# EAGLE schematic OBI_SlaveBoard_final (EAGLE 7.1.0)
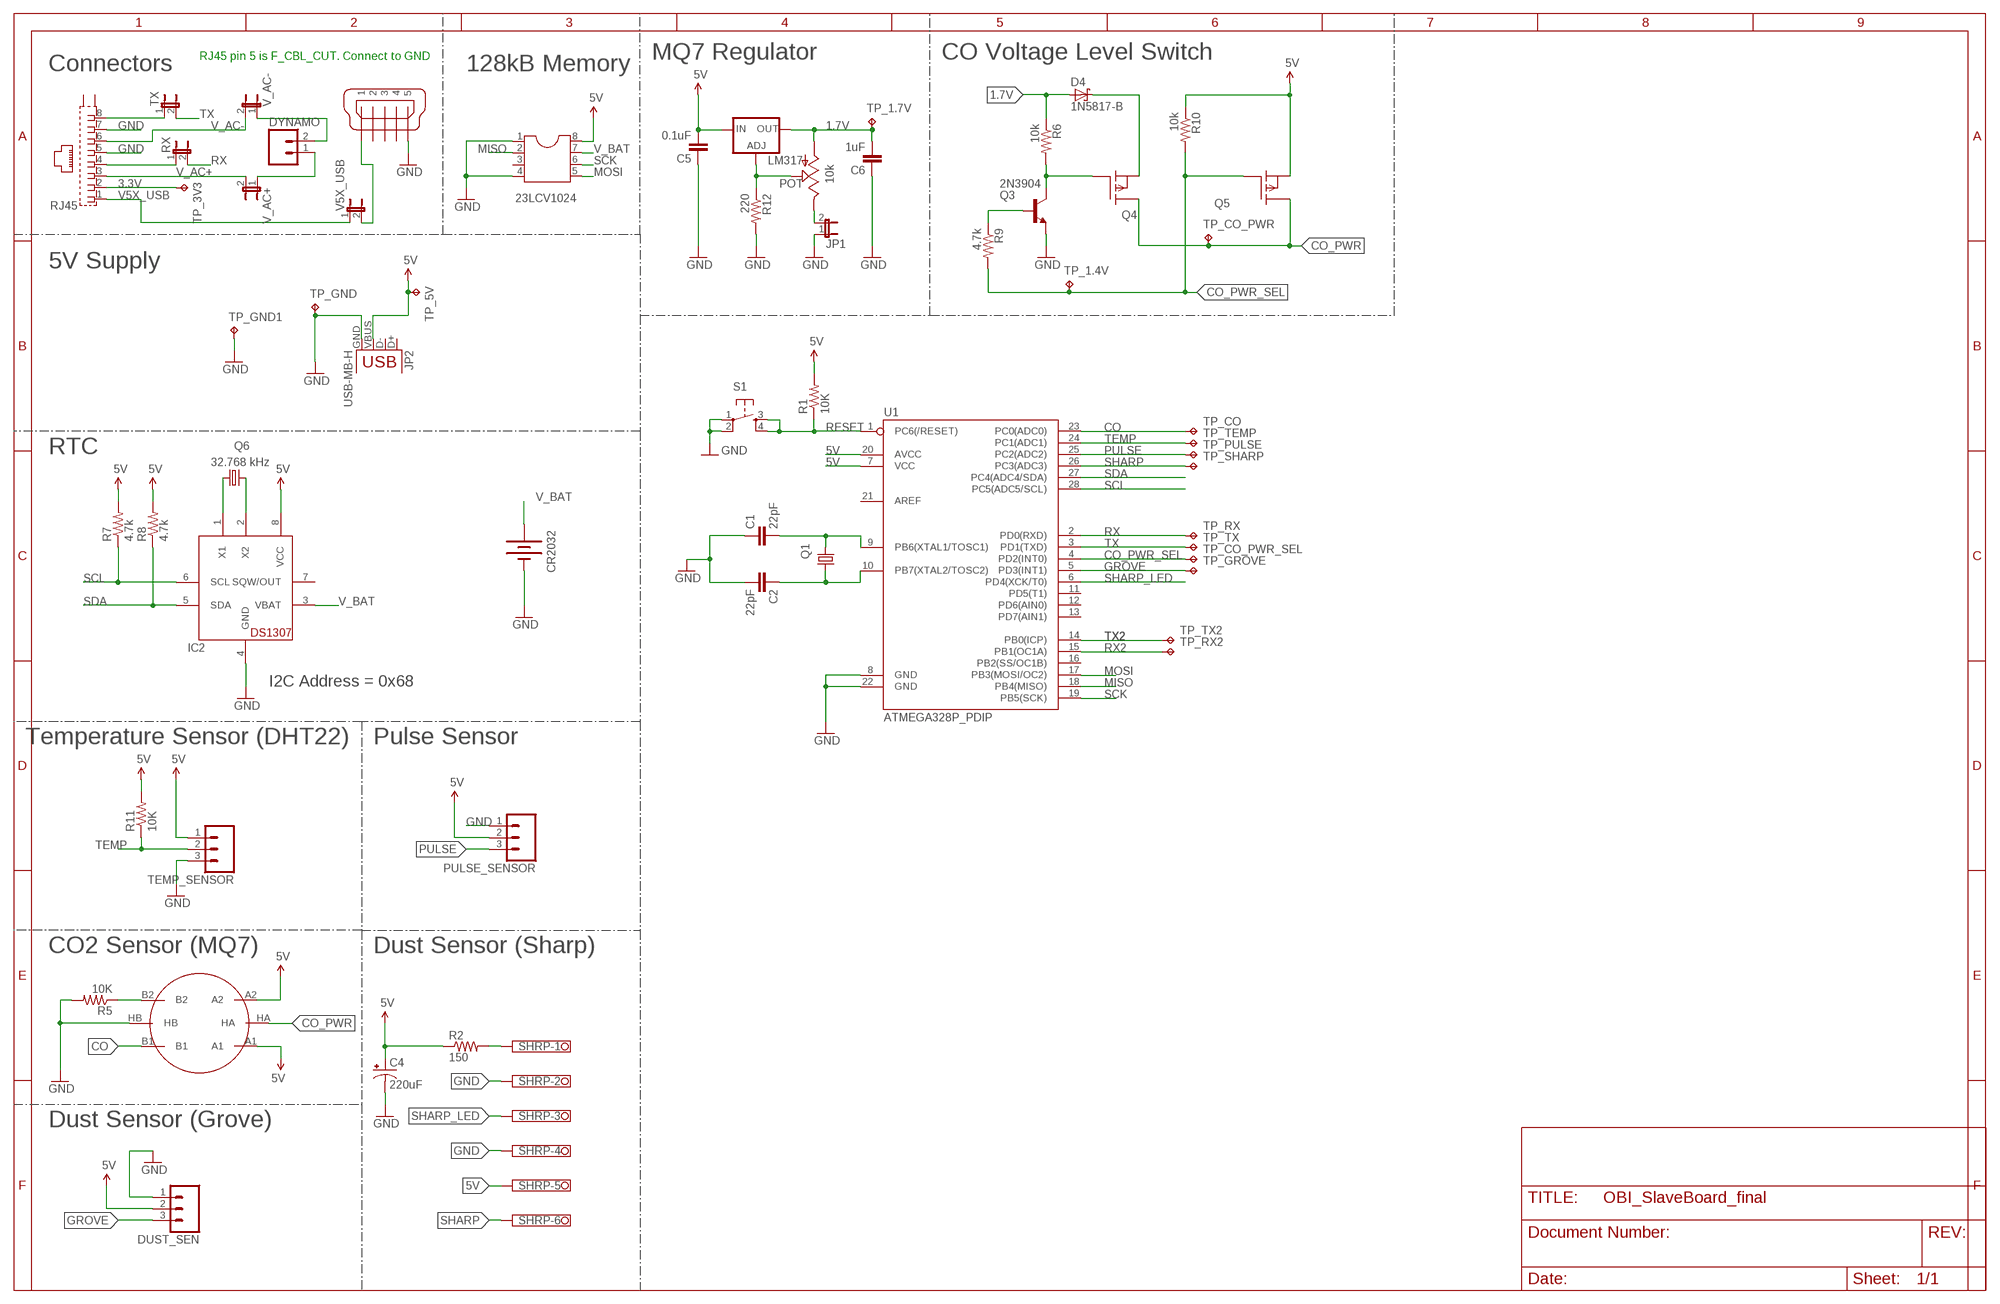
[diagram p0: schematic, sheet 1]

## Parts
23LCV1024  DIL8S  [SOCKET-08]
C1  22pF  C-EU025-024X044  [C025-024X044]
C2  22pF  C-EU025-024X044  [C025-024X044]
C4  220uF  CAP_POLPTH2  [CPOL-RADIAL-10UF-25V]
C5  0.1uF  C-EU025-024X044  [C025-024X044]
C6  1uF  C-EU025-024X044  [C025-024X044]
CO2_SENSOR  METHANE_SENSOR  [MQ-3]
CR2032  BATTERY20PTH  [BATTCOM_20MM_PTH]
D4  1N5817-B  SCHOTTKY-DIODEDO41  [DO41-10]
DUST_SEN  M03SCREW  [SCREWTERMINAL-3.5MM-3]
DYNAMO  M023.5MM  [SCREWTERMINAL-3.5MM-2]
IC2  DS1307  [DIL08]
JP1  JP1E  [JP1]
JP2  USB-MB-H  [USB-MB-H]
LM317  LM317TS  [317TS]
MICROB  MICRO-USB-ZX62R-B-5P  [ZX62R-B-5P]
POT  10k  TRIM_US-CT6  [CT6]
PULSE_SENSOR  M03SCREW  [SCREWTERMINAL-3.5MM-3]
Q1  CRYSTALHC49S  [HC49/S]
Q3  2N3904  TRANSISTOR_NPN2N3904  [TO-92]
Q4  BSS110  [TO92]
Q5  BSS110  [TO92]
Q6  32.768 kHz  CRYSTALTC26V  [TC26V]
R1  10K  R-US_0207/2V  [0207/2V]
R2  150  R-US_0207/2V  [0207/2V]
R5  10K  R-US_0207/2V  [0207/2V]
R6  10k  R-US_0207/2V  [0207/2V]
R7  4.7k  R-US_0207/2V  [0207/2V]
R8  4.7k  R-US_0207/2V  [0207/2V]
R9  4.7k  R-US_0207/2V  [0207/2V]
R10  10k  R-US_0207/2V  [0207/2V]
R11  10K  R-US_0207/2V  [0207/2V]
R12  220  R-US_0207/2V  [0207/2V]
RJ45  0446200002  [0446200002]
RX  JP1E  [JP1]
S1  TAC_SWITCHPTH  [TACTILE-PTH]
SHRP  1751280  [1751280]
TEMP_SENSOR  M03SCREW  [SCREWTERMINAL-3.5MM-3]
TP_1.4V  TPPAD1-13  [P1-13]
TP_1.7V  TPPAD1-13  [P1-13]
TP_3V3  TPPAD1-13  [P1-13]
TP_5V  TPPAD1-13  [P1-13]
TP_CO  TPPAD1-13  [P1-13]
TP_CO_PWR  TPPAD1-13  [P1-13]
TP_CO_PWR_SEL  TPPAD1-13  [P1-13]
TP_GND  TPPAD1-13  [P1-13]
TP_GND1  TPPAD1-13  [P1-13]
TP_GROVE  TPPAD1-13  [P1-13]
TP_PULSE  TPPAD1-13  [P1-13]
TP_RX  TPPAD1-13  [P1-13]
TP_RX2  TPPAD1-13  [P1-13]
TP_SHARP  TPPAD1-13  [P1-13]
TP_TEMP  TPPAD1-13  [P1-13]
TP_TX  TPPAD1-13  [P1-13]
TP_TX2  TPPAD1-13  [P1-13]
TX  JP1E  [JP1]
U1  ATMEGA328P_PDIP  [DIL28-3]
V5X_USB  JP1E  [JP1]
V_AC+  JP1E  [JP1]
V_AC-  JP1E  [JP1]

## Nets
1.7V [Power]: C6.2 D4.A LM317.2(OUT) POT.A R6.1 TP_1.7V.TP
3.3V [Power]: RJ45.2 TP_3V3.TP
5V [Power]: 23LCV1024.8 C4.1(+) C5.2 CO2_SENSOR.A1 CO2_SENSOR.A2 DUST_SEN.2 IC2.8(VCC) JP2.VBUS LM317.3(IN) PULSE_SENSOR.2 Q5.1(S) R1.2 R2.1 R7.2 R8.2 R10.1 R11.2 SHRP.5 TEMP_SENSOR.1 TP_5V.TP U1.7(VCC) U1.20(AVCC)
CO: CO2_SENSOR.B1 TP_CO.TP U1.23(PC0(ADC0))
CO_PWR [Power]: CO2_SENSOR.HA Q4.3(D) Q5.3(D) TP_CO_PWR.TP
CO_PWR_SEL: Q5.2(G) R9.2 R10.2 TP_1.4V.TP TP_CO_PWR_SEL.TP U1.4(PD2(INT0))
GND [Ground]: 23LCV1024.1 23LCV1024.4 C1.1 C2.2 C4.2(-) C5.1 C6.1 CO2_SENSOR.HB CR2032.2(-) DUST_SEN.1 IC2.4(GND) JP1.1 JP2.GND MICROB.5 PULSE_SENSOR.1 Q3.1(E) R5.2 R12.2 RJ45.5 RJ45.7 S1.1 S1.2 SHRP.2 SHRP.4 TEMP_SENSOR.3 TP_GND1.TP TP_GND.TP U1.8(GND) U1.22(GND)
GROVE: DUST_SEN.3 TP_GROVE.TP U1.5(PD3(INT1))
MISO: 23LCV1024.2 U1.18(PB4(MISO))
MOSI: 23LCV1024.5 U1.17(PB3(MOSI/OC2))
N$1: IC2.1(X1) Q6.1
N$2: Q3.3(C) Q4.2(G) R6.2
N$3: C1.2 Q1.2 U1.9(PB6(XTAL1/TOSC1))
N$4: Q3.2(B) R9.1
N$5: C2.1 Q1.1 U1.10(PB7(XTAL2/TOSC2))
N$6: IC2.2(X2) Q6.2
N$7: RJ45.4 RX.1
N$8: R2.2 SHRP.1
N$9: LM317.1(ADJ) POT.S R12.1
N$10: RJ45.8 TX.1
N$11 [Power]: DYNAMO.1 V_AC+.1
N$12 [Power]: MICROB.1 V5X_USB.2
N$13: JP1.2 POT.E
N$14 [Power]: DYNAMO.2 V_AC-.1
N$15: D4.C Q4.1(S)
N$17: CO2_SENSOR.B2 R5.1
PULSE: PULSE_SENSOR.3 TP_PULSE.TP U1.25(PC2(ADC2))
RESET: R1.1 S1.3 S1.4 U1.1(PC6(/RESET))
RX: RX.2 TP_RX.TP U1.2(PD0(RXD))
RX2: TP_RX2.TP U1.15(PB1(OC1A))
SCK: 23LCV1024.6 U1.19(PB5(SCK))
SCL: IC2.6(SCL) R7.1 U1.28(PC5(ADC5/SCL))
SDA: IC2.5(SDA) R8.1 U1.27(PC4(ADC4/SDA))
SHARP: SHRP.6 TP_SHARP.TP U1.26(PC3(ADC3))
SHARP_LED: SHRP.3 U1.6(PD4(XCK/T0))
TEMP: R11.1 TEMP_SENSOR.2 TP_TEMP.TP U1.24(PC1(ADC1))
TX: TP_TX.TP TX.2 U1.3(PD1(TXD))
TX2: TP_TX2.TP U1.14(PB0(ICP))
V5X_USB [Power]: RJ45.1 V5X_USB.1
V_AC+ [Power]: RJ45.3 V_AC+.2
V_AC- [Power]: RJ45.6 V_AC-.2
V_BAT: 23LCV1024.7 CR2032.1(+) IC2.3(VBAT)
Unconnected: 23LCV1024.3 IC2.7(SQW/OUT) JP2.D+ JP2.D- MICROB.2 MICROB.3 MICROB.4 RJ45.S@1(S1) RJ45.S@2(S2) U1.11(PD5(T1)) U1.12(PD6(AIN0)) U1.13(PD7(AIN1)) U1.16(PB2(SS/OC1B)) U1.21(AREF)

## Notes on the sheet
- RJ45 pin 5 is F_CBL_CUT. Connect to GND | MQ7 Regulator | CO Voltage Level Switch
- Connectors | 128kB Memory
- 5V Supply
- RTC
- I2C Address = 0x68
- Temperature Sensor (DHT22) | Pulse Sensor
- CO2 Sensor (MQ7) | Dust Sensor (Sharp)
- Dust Sensor (Grove)

## Library data of the parts
23LCV1024 = ic-package:DIL8: Dual In Line / Socket
C1 C2 C5 C6 = rcl:C-EU: CAPACITOR, European symbol
C4 = SparkFun-Capacitors:CAP_POL: Capacitor Polarized These are standard SMD and PTH capacitors. Normally 10uF, 47uF, and 100uF in electrolytic and tantalum varieties. Always verify the external diameter of the through hole cap, it varies with capacity, voltage, and manufacturer. The EIA devices should be standard.
CO2_SENSOR = SparkFun-Sensors:METHANE_SENSOR: MQ-4 Methane Gas Sensor SEN-09404
CR2032 = SparkFun-Electromechanical:BATTERY: Battery Holders Various common sizes : AA, AAA, 18650 (PRT-12895), 20mm coin cell and 12mm coin cell. 20MM_4LEGS, BATT-10373
D4 = adafruit:SCHOTTKY-DIODE: Schottky Diode
DUST_SEN PULSE_SENSOR TEMP_SENSOR = SparkFun-Connectors:M03: Header 3 Standard 3-pin 0.1" header. Use with straight break away headers (SKU : PRT-00116), right angle break away headers (PRT-00553), swiss pins (PRT-00743), machine pins (PRT-00117), and female headers (PRT-00115). Molex polarized connector foot print use with SKU : PRT-08232 with associated crimp pins and housings.
DYNAMO = SparkFun-Connectors:M02: Standard 2-pin 0.1" header. Use with - straight break away headers ( PRT-00116) - right angle break away headers (PRT-00553) - swiss pins (PRT-00743) - machine pins (PRT-00117) - female headers (PRT-00115) Molex polarized connector foot print use with: PRT-08233 with associated crimp pins and housings. 2.54_SCREWTERM for use with PRT-10571. 3.5mm Screw Terminal footprints for PRT-08084 5mm Screw Terminal footprints for use with PRT-08432; PROD_ID: CONN-08399
IC2 = adafruit:DS1307: DS1307 Real time clock (RTC) with battery backup ability. Talk to it via i2c
JP1 RX TX V5X_USB V_AC+ V_AC- = jumper:JP1E: JUMPER
JP2 = SparkFun-Connectors:USB: USB Connectors USB-B-PTH is fully proven SKU : PRT-00139/CONN-08278 USB-miniB is fully proven SKU : PRT-00587 USB-A-PCB is untested. USB-A-H is throughly reviewed, but untested. Spark Fun Electronics SKU : PRT-00437 USB-B-SMT is throughly reviewed, but untested. Needs silkscreen touching up. USB-A-S has not been used/tested USB-MB-H has not been used/tested USB-MICROB has been used. CONN-09505
LM317 = v-reg:LM317TS: VOLTAGE REGULATOR
MICROB = con-hirose:MICRO-USB-: Hirose Micro USB Connector ZX62R-B-5P: Micro B, reverse (top mount) shell SMT Supplier: DigiKey H11574CT-ND Source: http://www.hirose.co.jp/cataloge_hp/e24200011.pdf
POT = pot:TRIM_US-: POTENTIOMETER
Q1 = crystal:CRYSTAL: CRYSTAL; OC_FARNELL: 1667008; OC_NEWARK: unknown
Q3 = SparkFun-DiscreteSemi:TRANSISTOR_NPN: Generic NPN BJT MMBT2222A - TRANS-08049 (SOT-23, 1A 40V) MPSA42 - TRANS-09116 (SOT-23, 500mA 300V) MMBT5088LT1G - TRANS-11160 (SOT-23, 50 mA 30V) BC547 - COM-08928 <http://www.sparkfun.com/products/8928> (TO-92 45V 100mA) (1.Collector 2.Base 3.Emitter) 2N3904 - COM-00521 <http://www.sparkfun.com/products/521> (TO-92 40V 200mA) (1.Emitter 2.Base 3.Collector) P2N2222A - COM-12852 <http://www.sparkfun.com/products/12852> (TO-92 40V 600mA) (1.Collector 2.Base 3.Emitter); PROD_ID: TRANS-08447
Q4 Q5 = transistor-fet:BSS110: P-Channel Enhancement MOSFET -50V; -0,17A; 6Ohm
Q6 = crystal:CRYSTAL: CRYSTAL; OC_FARNELL: unknown; OC_NEWARK: unknown
R1 R2 R5-R12 = rcl:R-US_: RESISTOR, American symbol
RJ45 = con-molex:0446200002: RJ-45 INVERTED MODULAR JACK ASSEMBLY WITH RJ-11 KEEPOUT FEATURE Source: Data sheet <http://www.farnell.com/datasheets/73207.pdf> MOLEX 0446200002 BUCHSE, RJ45, GESCHIRMT Source: Farnell <http://de.farnell.com/molex/0446200002/buchse-rj45-geschirmt/dp/9251910?ost=9251910>; MF: MOLEX; MPN: 0446200002; OC_FARNELL: 9251910
S1 = SparkFun-Retired:TAC_SWITCH: Momentary Switch Button commonly used for reset or general input. Spark Fun Electronics SKU : COM-00097 SMT- SWCH-08247
SHRP = con-phoenix-350:1751280: MKDS 1/ 6-3,5 Printklemme Nennstrom: 10 A Bemessungsspannung: 160 V Raster: 3,5 mm Polzahl: 6 Montageart: Löten Anschlussart: Schraubanschluss Anschlussrichtung vom Leiter zur Platine: 0° Source: http://eshop.phoenixcontact.com .. 1751280.pdf; MPN: 1751280; OC_FARNELL: unknown; OC_NEWARK: 27R1765
TP_1.4V TP_1.7V TP_3V3 TP_5V TP_CO TP_CO_PWR TP_CO_PWR_SEL TP_GND TP_GND1 TP_GROVE TP_PULSE TP_RX TP_RX2 TP_SHARP TP_TEMP TP_TX TP_TX2 = testpad:TP: Test pad
U1 = SparkFun-DigitalIC:ATMEGA328P_PDIP: uC used in the Arduino 32kb flash, 1k EEPROM, 2k SRAM This is the through-hole version of this chip.

## Net classes
1 Power: width 0.381 mm
2 Ground: width 0.508 mm